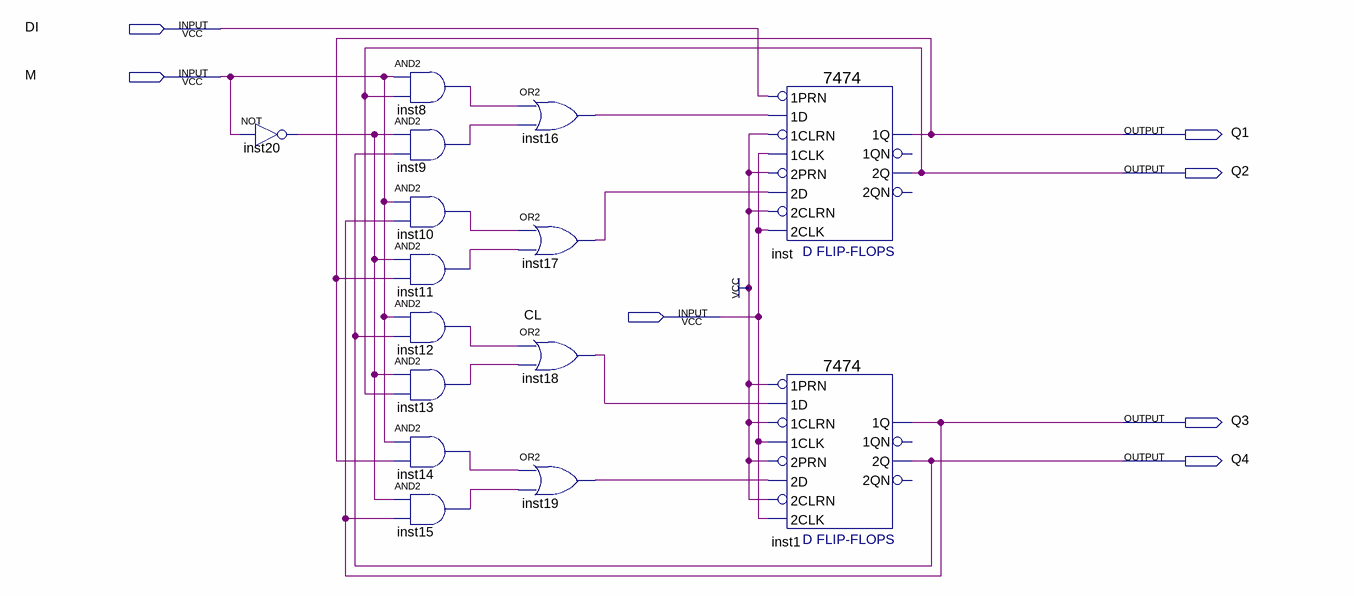
[diagram p0: schematic sheet]
// Quartus schematic ex2.bdf as structural Verilog: 15 symbols, 7 pins
module ex2 (
  input  DI,
  input  M,
  input  CL,
  output Q1,
  output Q2,
  output Q3,
  output Q4
);

  wire inst8_out, inst9_out, inst10_out, inst11_out, inst12_out, inst13_out, inst14_out, inst15_out,
       inst16_out, inst17_out, inst18_out, inst19_out, inst20_out;

  not inst20 (inst20_out, M);
  and inst8 (inst8_out, M, Q2);
  and inst9 (inst9_out, inst20_out, Q4);
  and inst10 (inst10_out, M, Q3);
  and inst11 (inst11_out, inst20_out, Q1);
  and inst12 (inst12_out, M, Q4);
  and inst13 (inst13_out, inst20_out, Q2);
  and inst14 (inst14_out, M, Q1);
  and inst15 (inst15_out, inst20_out, Q3);
  or inst16 (inst16_out, inst8_out, inst9_out);
  or inst17 (inst17_out, inst10_out, inst11_out);
  or inst18 (inst18_out, inst12_out, inst13_out);
  or inst19 (inst19_out, inst14_out, inst15_out);
  \7474  inst (
    .\2D (inst17_out), .\2PRN (1'b1), .\1CLK (CL), .\1D (inst16_out), .\1PRN (DI), .\2CLK (CL),
    .\2CLRN (1'b1), .\1CLRN (1'b1), .\2Q (Q2), .\1Q (Q1));  // open: 1QN, 2QN
  \7474  inst1 (
    .\2D (inst19_out), .\2PRN (1'b1), .\1CLK (CL), .\1D (inst18_out), .\1PRN (1'b1), .\2CLK (CL),
    .\2CLRN (1'b1), .\1CLRN (1'b1), .\2Q (Q4), .\1Q (Q3));  // open: 1QN, 2QN
endmodule
